# Altium schematic sheet Power Generation - LDO.SchDoc: [6] Power Generation - LDO
size A4; ApprovedBy: Nagy Richard; CheckedBy: Power Generation - LDO; Author: Power Generation - LDO; CompanyName: EmbedCore; DrawnBy: Power Generation - LDO; Engineer: Power Generation - LDO; Organization: EmbedCore; Revision: 1.0; SheetNumber: 6; SheetTotal: 7
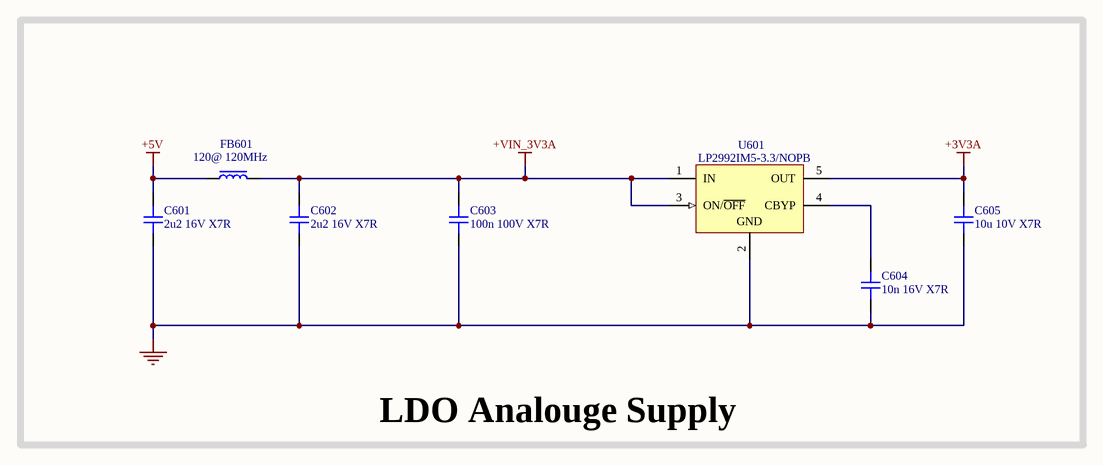
[diagram p0: Power Generation - LDO.SchDoc]

## Parts
C601  2u2 16V X7R  [CAP_0805]
C602  2u2 16V X7R  [CAP_0805]
C603  100n 100V X7R  [CAP_0805]
C604  10n 16V X7R  [CAP_0603]
C605  10u 10V X7R  [CAP_0805]
FB601  120@ 120MHz  [FB_0805]
U601  LP2992IM5-3.3/NOPB  [DBV0005A_L]

## Blocks framed on the sheet
LDO Analouge Supply: C601-C605 FB601 U601

## Nets
+3V3A: C605.1 U601.5(OUT)
+5V: C601.1 FB601.1
+VIN_3V3A: C602.1 C603.1 FB601.2 U601.1(IN) U601.3(ON/~{OFF})
GND: C601.2 C602.2 C603.2 C604.1 C605.2 U601.2(GND)
NetC604_2: C604.2 U601.4(CBYP)

## Notes on the sheet
- Title:
- Drawn By:
- Page Contents:
- Checked By:
- Size:
- Date:
- File:
- License:
- Email:
- A4
- Number:
- Time:
- Revision:
- Sheet
- Website:
- of

## Library data of the parts
C601 C602 = CAP_0805: Capacitor SMD 0805; Manufacturer: HRE; Manufacturer Part Number: CGA0805X7R225K160MT; Distributor Link: www.lcsc.com; LCSC: C6119936; Rating: *; Dielectric: *
C603 = CAP_0805: Capacitor SMD 0805; Manufacturer: YAGEO; Manufacturer Part Number: CC0805JRX7R7BB104; Distributor Link: www.lcsc.com; LCSC: CC0805JRX7R7BB104; Rating: *; Dielectric: *
C604 = CAP_0603: Capacitor SMD 0603; Manufacturer: YAGEO; Manufacturer Part Number: CC0603JRX7R7BB103; Distributor Link: www.lcsc.com; LCSC: C519509; Rating: *; Dielectric: *
C605 = CAP_0805: Capacitor SMD 0805; Manufacturer: Murata Electronics; Manufacturer Part Number: GCM21BR71A106KE22K; Distributor Link: www.lcsc.com; LCSC: C2167756; Rating: *; Dielectric: *
FB601 = FB_0805: Ferrite Bead SMD 0805; Manufacturer: Murata Electronics; Manufacturer Part Number: BLM21AG121SN1D; Distributor Link: www.lcsc.com; LCSC: C88990
U601 = CMP-0062-02175-3: Micropower 250 mA Low-Noise Ultra Low-Dropout Regulator, 5-pin SOT-23, Pb-Free; Manufacturer: Texas Instruments; CompType: LDO IC; PackageTopMarking: LFEB*XTT; PowerWise: N; PackageReference: DBV0005A; ComponentLink1Description: Datasheet URL; RoHS: Y; PackageDescription: Molded SOT-23, .115 x .063 x .040 in Body, 5 Lead, .0375 in Pitch; ComponentLink1URL: http://www.ti.com/general/docs/lit/getliterature.tsp?genericPartNumber=LP2992&fileType=pdf; PinCount: 5